# Altium project DataloggerHMIV9.PrjPcb
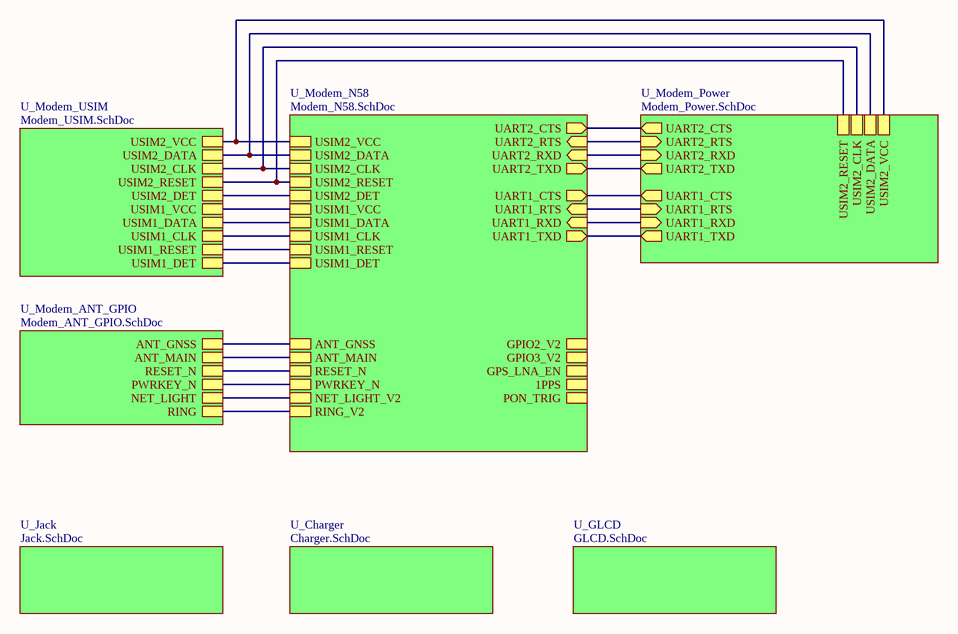
[diagram p0: Master.SchDoc]
4 sheets, 203 parts. Net scope: hierarchical (ports join the sheet entries above them; power ports are global).
Board file: DataloggerMini.PcbDoc
Sheets:
  Master.SchDoc
    U_Jack = Jack.SchDoc
    U_Charger = Charger.SchDoc
    U_GLCD = GLCD.SchDoc

## Sheet Master.SchDoc
size A4; Organization: Altium Limited; Address1: L3, 12a Rodborough Rd; Address2: Frenchs Forest; Address3: NSW; Address4: Australia 2086; DocumentNumber: 1; SheetNumber: 1; SheetTotal: 8

### Sub-sheets
U_Charger = Charger.SchDoc: no entries
U_GLCD = GLCD.SchDoc: no entries
U_Jack = Jack.SchDoc: no entries
U_Modem_ANT_GPIO = Modem_ANT_GPIO.SchDoc (file not in this document): ANT_GNSS, ANT_MAIN, RESET_N, PWRKEY_N, NET_LIGHT, RING
U_Modem_N58 = Modem_N58.SchDoc (file not in this document): RING_V2, USIM2_VCC, USIM2_DATA, USIM2_CLK, USIM2_RESET, USIM2_DET, USIM1_VCC, USIM1_DATA, USIM1_CLK, USIM1_RESET, USIM1_DET, RESET_N, PWRKEY_N, PON_TRIG, UART2_RTS (in), UART2_CTS (out), UART2_RXD (in), UART2_TXD (out), GPIO2_V2, GPIO3_V2, ANT_MAIN, GPS_LNA_EN, 1PPS, ANT_GNSS, NET_LIGHT_V2, UART1_RTS (in), UART1_CTS (out), UART1_RXD (in), UART1_TXD (out)
U_Modem_Power = Modem_Power.SchDoc (file not in this document): UART2_RTS (in), UART2_TXD (out), UART2_RXD (in), UART2_CTS (out), UART1_RTS (in), UART1_TXD (out), UART1_RXD (in), UART1_CTS (out), USIM2_VCC, USIM2_DATA, USIM2_CLK, USIM2_RESET
U_Modem_USIM = Modem_USIM.SchDoc (file not in this document): USIM1_VCC, USIM1_DET, USIM1_DATA, USIM1_CLK, USIM1_RESET, USIM2_VCC, USIM2_DET, USIM2_DATA, USIM2_CLK, USIM2_RESET

### Nets
(unnamed): sheet U_Modem_Power/UART2_RTS, sheet U_Modem_N58/UART2_RTS
(unnamed): sheet U_Modem_Power/UART2_TXD, sheet U_Modem_N58/UART2_TXD
(unnamed): sheet U_Modem_Power/UART2_RXD, sheet U_Modem_N58/UART2_RXD
(unnamed): sheet U_Modem_Power/UART2_CTS, sheet U_Modem_N58/UART2_CTS
(unnamed): sheet U_Modem_Power/UART1_RTS, sheet U_Modem_N58/UART1_RTS
(unnamed): sheet U_Modem_Power/UART1_TXD, sheet U_Modem_N58/UART1_TXD
(unnamed): sheet U_Modem_Power/UART1_RXD, sheet U_Modem_N58/UART1_RXD
(unnamed): sheet U_Modem_Power/UART1_CTS, sheet U_Modem_N58/UART1_CTS
(unnamed): sheet U_Modem_Power/USIM2_VCC, sheet U_Modem_N58/USIM2_VCC, sheet U_Modem_USIM/USIM2_VCC
(unnamed): sheet U_Modem_Power/USIM2_DATA, sheet U_Modem_N58/USIM2_DATA, sheet U_Modem_USIM/USIM2_DATA
(unnamed): sheet U_Modem_Power/USIM2_CLK, sheet U_Modem_N58/USIM2_CLK, sheet U_Modem_USIM/USIM2_CLK
(unnamed): sheet U_Modem_Power/USIM2_RESET, sheet U_Modem_N58/USIM2_RESET, sheet U_Modem_USIM/USIM2_RESET
(unnamed): sheet U_Modem_N58/RING_V2, sheet U_Modem_ANT_GPIO/RING
(unnamed): sheet U_Modem_N58/USIM2_DET, sheet U_Modem_USIM/USIM2_DET
(unnamed): sheet U_Modem_N58/USIM1_VCC, sheet U_Modem_USIM/USIM1_VCC
(unnamed): sheet U_Modem_N58/USIM1_DATA, sheet U_Modem_USIM/USIM1_DATA
(unnamed): sheet U_Modem_N58/USIM1_CLK, sheet U_Modem_USIM/USIM1_CLK
(unnamed): sheet U_Modem_N58/USIM1_RESET, sheet U_Modem_USIM/USIM1_RESET
(unnamed): sheet U_Modem_N58/USIM1_DET, sheet U_Modem_USIM/USIM1_DET
(unnamed): sheet U_Modem_N58/RESET_N, sheet U_Modem_ANT_GPIO/RESET_N
(unnamed): sheet U_Modem_N58/PWRKEY_N, sheet U_Modem_ANT_GPIO/PWRKEY_N
(unnamed): sheet U_Modem_N58/ANT_MAIN, sheet U_Modem_ANT_GPIO/ANT_MAIN
(unnamed): sheet U_Modem_N58/ANT_GNSS, sheet U_Modem_ANT_GPIO/ANT_GNSS
(unnamed): sheet U_Modem_N58/NET_LIGHT_V2, sheet U_Modem_ANT_GPIO/NET_LIGHT

### Notes on the sheet
- Title
- Size:
- Date:
- MiniDatalogger
- A4
- Time:
- Drawn by:
- Bach
- Revision:
- Sheet
- of
- Sonrad
- 385 Tran Dai Nghia
- Hai Ba Trung
- Ha Noi
- Viet Nam
- File:

## Sheet Jack.SchDoc
size Tabloid; Organization: Altium Limited; Address1: L3, 12a Rodborough Rd; Address2: Frenchs Forest; Address3: NSW; Address4: Australia 2086; DocumentNumber: 8; SheetNumber: 8; SheetTotal: 8
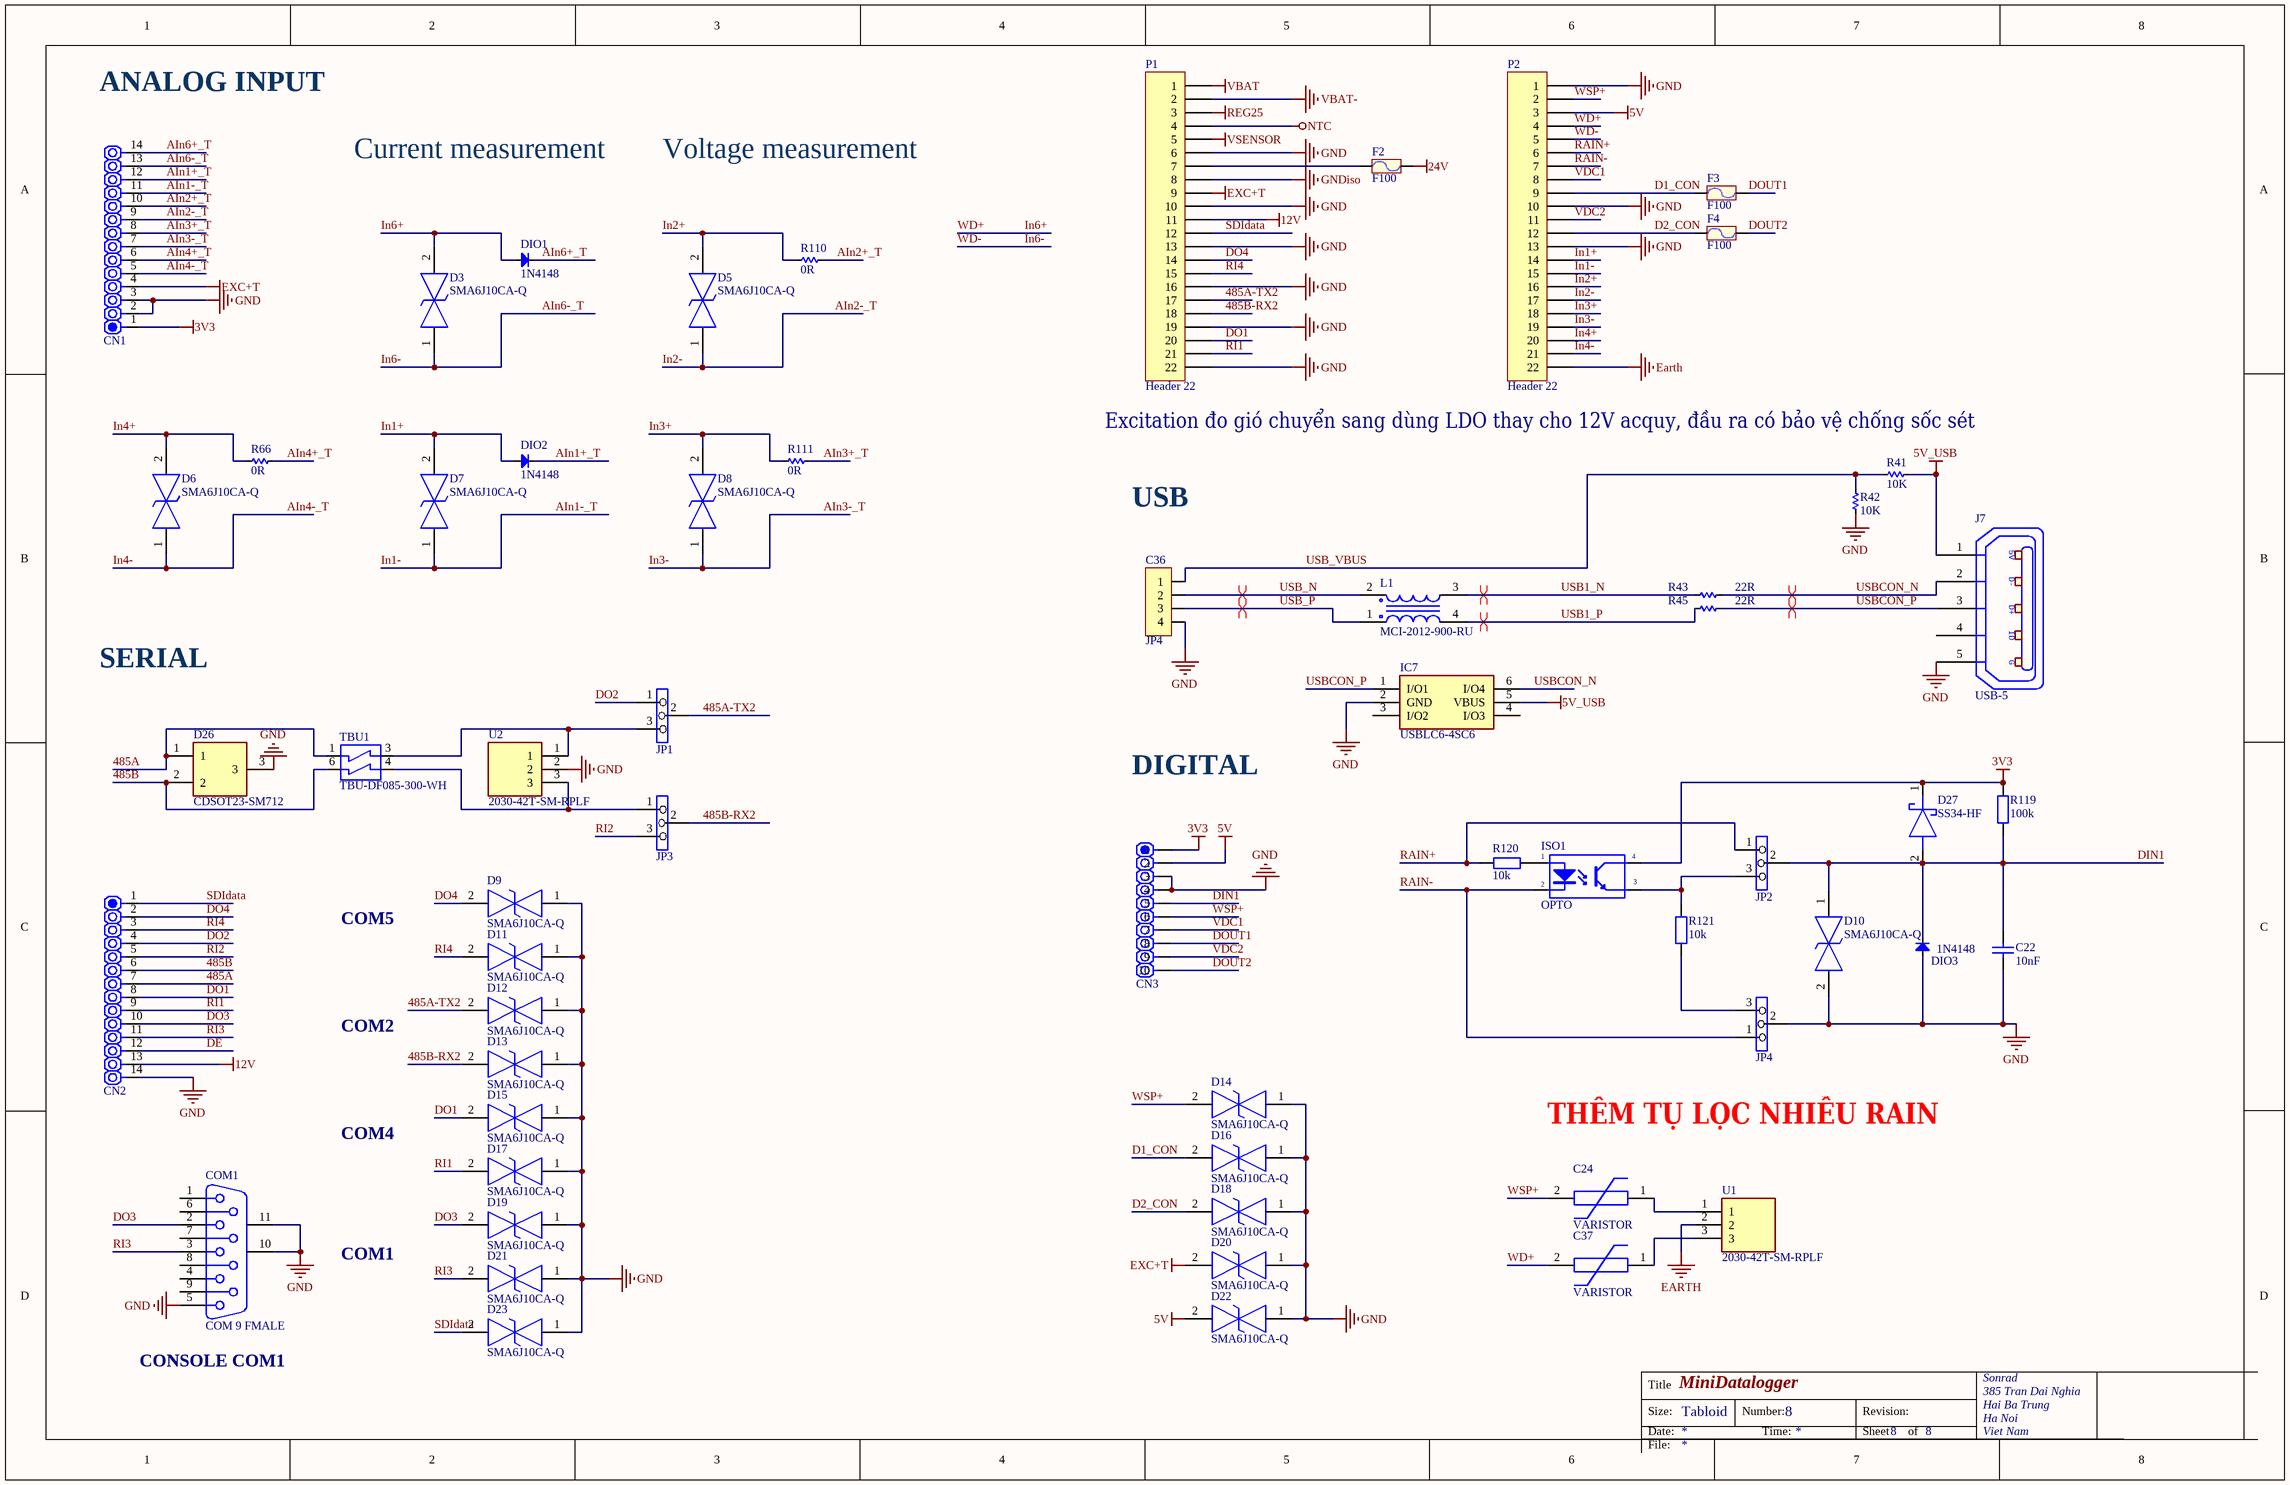
[diagram p1: Jack.SchDoc]

### Parts
C22  10nF  [0805 CAP]
C24  VARISTOR  [CN2]
C36  JP4  [JP4-C1T]
C37  VARISTOR  [CN2]
CN1  CON.HDR1x14  [CON1X14N]  (value not drawn)
CN2  CON.HDR1x14  [CON1X14N]  (value not drawn)
CN3  CON.HDR1x10  [HDR1X10]  (value not drawn)
COM1  COM 9 FMALE  [61800925123]
D3  SMA6J10CA-Q  [DIONM5127X229N]
D5  SMA6J10CA-Q  [DIONM5127X229N]
D6  SMA6J10CA-Q  [DIONM5127X229N]
D7  SMA6J10CA-Q  [DIONM5127X229N]
D8  SMA6J10CA-Q  [DIONM5127X229N]
D9  SMA6J10CA-Q  [DIONM5127X229N]
D10  SMA6J10CA-Q  [DIONM5127X229N]
D11  SMA6J10CA-Q  [DIONM5127X229N]
D12  SMA6J10CA-Q  [DIONM5127X229N]
D13  SMA6J10CA-Q  [DIONM5127X229N]
D14  SMA6J10CA-Q  [DIONM5127X229N]
D15  SMA6J10CA-Q  [DIONM5127X229N]
D16  SMA6J10CA-Q  [DIONM5127X229N]
D17  SMA6J10CA-Q  [DIONM5127X229N]
D18  SMA6J10CA-Q  [DIONM5127X229N]
D19  SMA6J10CA-Q  [DIONM5127X229N]
D20  SMA6J10CA-Q  [DIONM5127X229N]
D21  SMA6J10CA-Q  [DIONM5127X229N]
D22  SMA6J10CA-Q  [DIONM5127X229N]
D23  SMA6J10CA-Q  [DIONM5127X229N]
D26  CDSOT23-SM712  [SOT95P230X117-3N]
D27  SS34-HF  [DIOM5025X220N]
DIO1  1N4148  [DIO-SMD-123]
DIO2  1N4148  [DIO-SMD-123]
DIO3  1N4148  [DIO-SMD-123]
F2  F100  [Fuse1A]
F3  F100  [Fuse1A]
F4  F100  [Fuse1A]
IC7  USBLC6-4SC6  [SOT95P280X145-6N]
ISO1  OPTO  [PC817 SMD]
J7  USB-5  [USB_B_MINI_SMD]
JP1  Jumper 3 pins  [Header 3]  (value not drawn)
JP2  Jumper 3 pins  [Header 3]  (value not drawn)
JP3  Jumper 3 pins  [Header 3]  (value not drawn)
JP4  Jumper 3 pins  [Header 3]  (value not drawn)
L1  MCI-2012-900-RU  [MCI-2012-900-RU]
P1  Header 22  [KF250_KEFA_22P_PHOENIX]
P2  Header 22  [KF250_KEFA_22P_PHOENIX]
R41  10K  [RES-SMD-0805]
R42  10K  [RES-SMD-0805]
R43  22R  [RES-SMD-0805]
R45  22R  [RES-SMD-0805]
R66  0R  [RES-SMD-0805]
R110  0R  [RES-SMD-0805]
R111  0R  [RES-SMD-0805]
R119  100k  [SM-0805]
R120  10k  [SM-0805]
R121  10k  [SM-0805]
TBU1  TBU-DF085-300-WH  [TBU-DF085-300-WH]
U1  2030-42T-SM-RPLF  [203042TSMRPLF]
U2  2030-42T-SM-RPLF  [203042TSMRPLF]

### Nets
3V3: CN1.1 CN3.1 D27.1(K) ISO1.4(C) R119.2
5V: CN3.2 D22.2 P2.3
5V_USB: IC7.5(VBUS) J7.1(P1) R41.1
12V: CN2.13 P1.11
24V: F2.2
Earth: P2.22 U1.2
EXC+T: CN1.4 D20.2 P1.9
GND: C22.1 C36.4 CN1.2 CN1.3 CN2.14 CN3.3 CN3.4 COM1.5 COM1.10(MH1) COM1.11(MH2) D9.1 D10.2 D11.1 D12.1 D13.1 D14.1 D15.1 D16.1 D17.1 D18.1 D19.1 D20.1 D21.1 D22.1 D23.1 D26.3 DIO3.1(A) IC7.2(GND) J7.5(P5) JP4.2 P1.6 P1.10 P1.13 P1.16 P1.19 P1.22 P2.1 P2.10 P2.13 R42.2 U2.2
GNDiso: P1.8
NTC: P1.4
REG25: P1.3
VBAT: P1.1
VBAT-: P1.2
VSENSOR: P1.5
485A: CN2.7 D26.1 TBU1.1(IN1)
485A-TX2: D12.2 JP1.2 P1.17
485B: CN2.6 D26.2 TBU1.6
485B-RX2: D13.2 JP3.2 P1.18
AIn1+_T: CN1.12 DIO2.2(K)
AIn1-_T: CN1.11 D7.1 P2.15  [also labelled In1-]
AIn2+_T: CN1.10 R110.1
AIn2-_T: CN1.9 D5.1 P2.17  [also labelled In2-]
AIn3+_T: CN1.8 R111.1
AIn3-_T: CN1.7 D8.1 P2.19  [also labelled In3-]
AIn4+_T: CN1.6 R66.1
AIn4-_T: CN1.5 D6.1 P2.21  [also labelled In4-]
AIn6+_T: CN1.14 DIO1.2(K)
AIn6-_T: CN1.13 D3.1 P2.5  [also labelled In6-, WD-]
D1_CON: D16.2 F3.1 P2.9
D2_CON: D18.2 F4.1 P2.12
DE: CN2.12
DIN1: C22.2 CN3.5 D10.1 D27.2(A) DIO3.2(K) JP2.2 R119.1
DO1: CN2.8 D15.2 P1.20
DO2: CN2.4 JP1.1
DO3: CN2.10 COM1.2 D19.2
DO4: CN2.2 D9.2 P1.14
DOUT1: CN3.8 F3.2
DOUT2: CN3.10 F4.2
In1+: D7.2 DIO2.1(A) P2.14
In2+: D5.2 P2.16 R110.2
In3+: D8.2 P2.18 R111.2
In4+: D6.2 P2.20 R66.2
In6+: C37.2 D3.2 DIO1.1(A) P2.4  [also labelled WD+]
RAIN+: JP2.1 P2.6 R120.1
RAIN-: ISO1.2(K) JP4.1 P2.7
RI1: CN2.9 D17.2 P1.21
RI2: CN2.5 JP3.3
RI3: CN2.11 COM1.3 D21.2
RI4: CN2.3 D11.2 P1.15
SDIdata: CN2.1 D23.2 P1.12
USB1_N: L1.3 R43.2
USB1_P: L1.4 R45.2
USB_N: C36.2 L1.2
USB_P: C36.3 L1.1
USB_VBUS: C36.1 R41.2 R42.1
USBCON_N: IC7.6(I/O4) J7.2(P2) R43.1
USBCON_P: IC7.1(I/O1) J7.3(P3) R45.1
VDC1: CN3.7 P2.8
VDC2: CN3.9 P2.11
WSP+: C24.2 CN3.6 D14.2 P2.2
NetC24_1: C24.1 U1.1
NetC37_1: C37.1 U1.3
NetF2_1: F2.1 P1.7
NetISO1_1: ISO1.1(A) R120.2
NetISO1_3: ISO1.3(E) JP2.3 R121.1
NetJP1_3: JP1.3 TBU1.3(IN1) U2.1
NetJP3_1: JP3.1 TBU1.4(IN1) U2.3
NetJP4_3: JP4.3 R121.2

Not connected (* = marked no-connect by the designer): COM1 1 4 6 7 8 9; IC7 3(I/O2) 4(I/O3); J7 4(P4)

### Layout directives
differential pair; differential pair class USB: USB1_N, USB1_P, USB_N, USB_P, USBCON_N, USBCON_P

### Notes on the sheet
- ANALOG INPUT
- Current measurement
- Voltage measurement
- Excitation đo gió chuyển sang dùng LDO thay cho 12V acquy, đầu ra có bảo vệ chống sốc sét
- USB
- SERIAL
- DIGITAL
- COM5
- COM2
- COM4
- THÊM TỤ LỌC NHIỄU RAIN
- COM1
- (near COM1) CONSOLE COM1
- Title
- Size:
- Date:
- MiniDatalogger
- Tabloid
- Number:
- Time:
- Revision:
- Sheet
- of
- Sonrad
- 385 Tran Dai Nghia
- Hai Ba Trung
- Ha Noi
- Viet Nam
- File:
- (in symbol USB-5) 5V; D-; D+; ID; G

### Library data of the parts
C22 = CAP CERAMIC: Published: 8-Jun-2000; LatestRevisionDate: 17-Jul-2002; LatestRevisionNote: Re-released for DXP Platform.; PackageReference: RAD-0.3; Publisher: Altium Limited
C24 C37 = VARISTOR: Value: VR 10K
C36 = JP4: WR-PHD 2.54 mm Angled Socket Header; Manufacturer: W¨¹rth Elektronik eiSos GmbH; partNo: 613004143121; ComponentLink1 Description: Manufacturer; ComponentLink2 Description: Datasheet; NoPins: 04; Created Date: 29 March 2013; ComponentLink1URL: http://www.we-online.com; ComponentLink2URL: http://katalog.we-online.de/em/datasheet/6130xx143121.pdf; Created by: Karrer Zheng
CN1 CN2 = CON.HDR1x14: Header 1x14; Publisher: Hoang Nguyen; ComponentLink1Description: Digikey Part link; ComponentLink2Description: Open DataSheet; ComponentLink2URL: H:\LIBRARY\LIBRARY.Datasheet\
CN3 = CON.HDR1x10: Header 1x10; Publisher: Hoang Nguyen; ComponentLink1Description: Digikey Part link; ComponentLink2Description: Open DataSheet; ComponentLink2URL: H:\LIBRARY\LIBRARY.Datasheet\
COM1 = DSB9F: COM 9; PackageDocument: O; Positions: 9; Gender: Receptacle; Value: COM 9; Published: 15-Jun-2001; LatestRevisionDate: 17-Jul-2002; LatestRevisionNote: Re-released for DXP Platform.; DatasheetDocument: 1-Sep-1999; PackageReference: 788750; Publisher: Altium Limited; Orientation: Right Angle
D3 D5-D23 = SMA6J10CA-Q: TVS Diode (Bi-directional); Manufacturer_Name: Bourns; Datasheet Link: https://www.bourns.com/docs/product-datasheets/sma6j-q.pdf?sfvrsn=4a9a7af6_53; Height: 2.29mm; Manufacturer_Part_Number: SMA6J10CA-Q; Mouser Part Number: 652-SMA6J10CA-Q; Mouser Price/Stock: https://www.mouser.co.uk/ProductDetail/Bourns/SMA6J10CA-Q?qs=BJlw7L4Cy79QGk2EpmeXhg%3D%3D
D26 = CDSOT23-SM712: Diode; Manufacturer_Name: Bourns; Datasheet Link: http://uk.rs-online.com/web/p/products/7673728; Height: 1.17mm; Manufacturer_Part_Number: CDSOT23-SM712; Mouser Part Number: 652-CDSOT23-SM712; Mouser Price/Stock: https://www.mouser.co.uk/ProductDetail/Bourns/CDSOT23-SM712?qs=FuI%252BOVLl4%2FLTY%2FGQ265RLA%3D%3D; Arrow Part Number: CDSOT23-SM712; Arrow Price/Stock: https://www.arrow.com/en/products/cdsot23-sm712/bourns
D27 = SS34-HF: Schottky Diode; Manufacturer_Name: Comchip Technology; Datasheet Link: https://ms.componentsearchengine.com/Datasheets/1/SS34-HF.pdf; Height: 2.2mm; Manufacturer_Part_Number: SS34-HF; Mouser Part Number: 750-SS34-HF; Mouser Price/Stock: https://www.mouser.co.uk/ProductDetail/Comchip-Technology/SS34-HF?qs=%252B6g0mu59x7Kt0FF4l3l3pg%3D%3D; Arrow Part Number: SS34-HF; Arrow Price/Stock: https://www.arrow.com/en/products/ss34-hf/comchip-technology
DIO1-DIO3 = Diode SMD: Default Diode; Code - JEDEC: DO-214-AB; Value: 1N5007; Published: 8-Jun-2000; Revision: July-2002: Re-released for DXP Platform.; Publisher: Altium Limited
F2-F4 = Fuse: Designed by: VanDungEvn; Value: Fuse
IC7 = USBLC6-4SC6: Integrated Circuit; Manufacturer_Name: STMicroelectronics; Datasheet Link: http://www.st.com/st-web-ui/static/active/en/resource/technical/document/datasheet/CD00047494.pdf; Height: 1.45mm; Manufacturer_Part_Number: USBLC6-4SC6; Mouser Part Number: 511-USBLC6-4SC6; Mouser Price/Stock: https://www.mouser.co.uk/ProductDetail/STMicroelectronics/USBLC6-4SC6?qs=k9dH%2Fx4GHJCNdehb8zInZg%3D%3D; Arrow Part Number: USBLC6-4SC6; Arrow Price/Stock: https://www.arrow.com/en/products/usblc6-4sc6/stmicroelectronics?region=nac
ISO1 = OPTO: Value: TLP5211
J7 = USB-5: Manufacturer: FCI; Manufacturer Part Number: 10118193-0001LF; Connector Type: USB - micro B; Number of Contacts: 5; Gender: Receptacle; Specifications: USB 2.0; .Creator: MM; .Checked PCB: RF; Supplier 1: Digi-Key; RoHS: RoHS Compliant; Category: Connectors, Interconnects; Stock 1: 28642; Pricing 1: 1=0.46, 10=0.433, 25=0.3712, 50=0.3156, 100=0.3032, 250=0.27224, 500=0.25988 (USD); Packaging: Cut Tape (CT); Mounting Type: Surface Mount, Right Angle, Horizontal; Features: Shielded, Solder Retention; Ingress Protection: -; ComponentLink1URL: http://portal.fciconnect.com/Comergent//fci/drawing/10118193.pdf; ComponentLink1Description: http://portal.fciconnect.com/Comergent//fci/drawing/10118193.pdf; Supplier Part Number 1: 609-4616-1-ND; .Checked SCH: MM
JP1-JP4 = Jumper3: ECCN_US/EU: n/a
R41-R43 R45 R66 R110 R111 = Res-SMD: Resistor; Manufacturer: Generic Components; Class: Passive; Published: 08/06/2000; Publisher: Altium Hobart Technology Centre
R119-R121 = RM: Resistor SMD; Value: 1K
U1 U2 = 2030-42T-SM-RPLF: Undefined or Miscellaneous; Manufacturer_Name: Bourns; Datasheet Link: https://www.mouser.com/datasheet/2/54/030-xxt-sm-776307.pdf; Height: 5.3mm; Manufacturer_Part_Number: 2030-42T-SM-RPLF; Mouser Part Number: 652-2030-42T-SM-RPLF; Mouser Price/Stock: https://www.mouser.co.uk/ProductDetail/Bourns/2030-42T-SM-RPLF?qs=5MvhVKkHFQUQcmaLkL8YYA%3D%3D; Arrow Part Number: 2030-42T-SM-RPLF; Arrow Price/Stock: https://www.arrow.com/en/products/2030-42t-sm-rplf/bourns
P1 P2 = Header 22: LatestRevisionDate: 17-Jul-2002; LatestRevisionNote: Re-released for DXP Platform.; Publisher: Altium Limited

## Sheet Charger.SchDoc
size Tabloid; Organization: Altium Limited; Address1: L3, 12a Rodborough Rd; Address2: Frenchs Forest; Address3: NSW; Address4: Australia 2086; DocumentNumber: 3; SheetNumber: 3; SheetTotal: 8
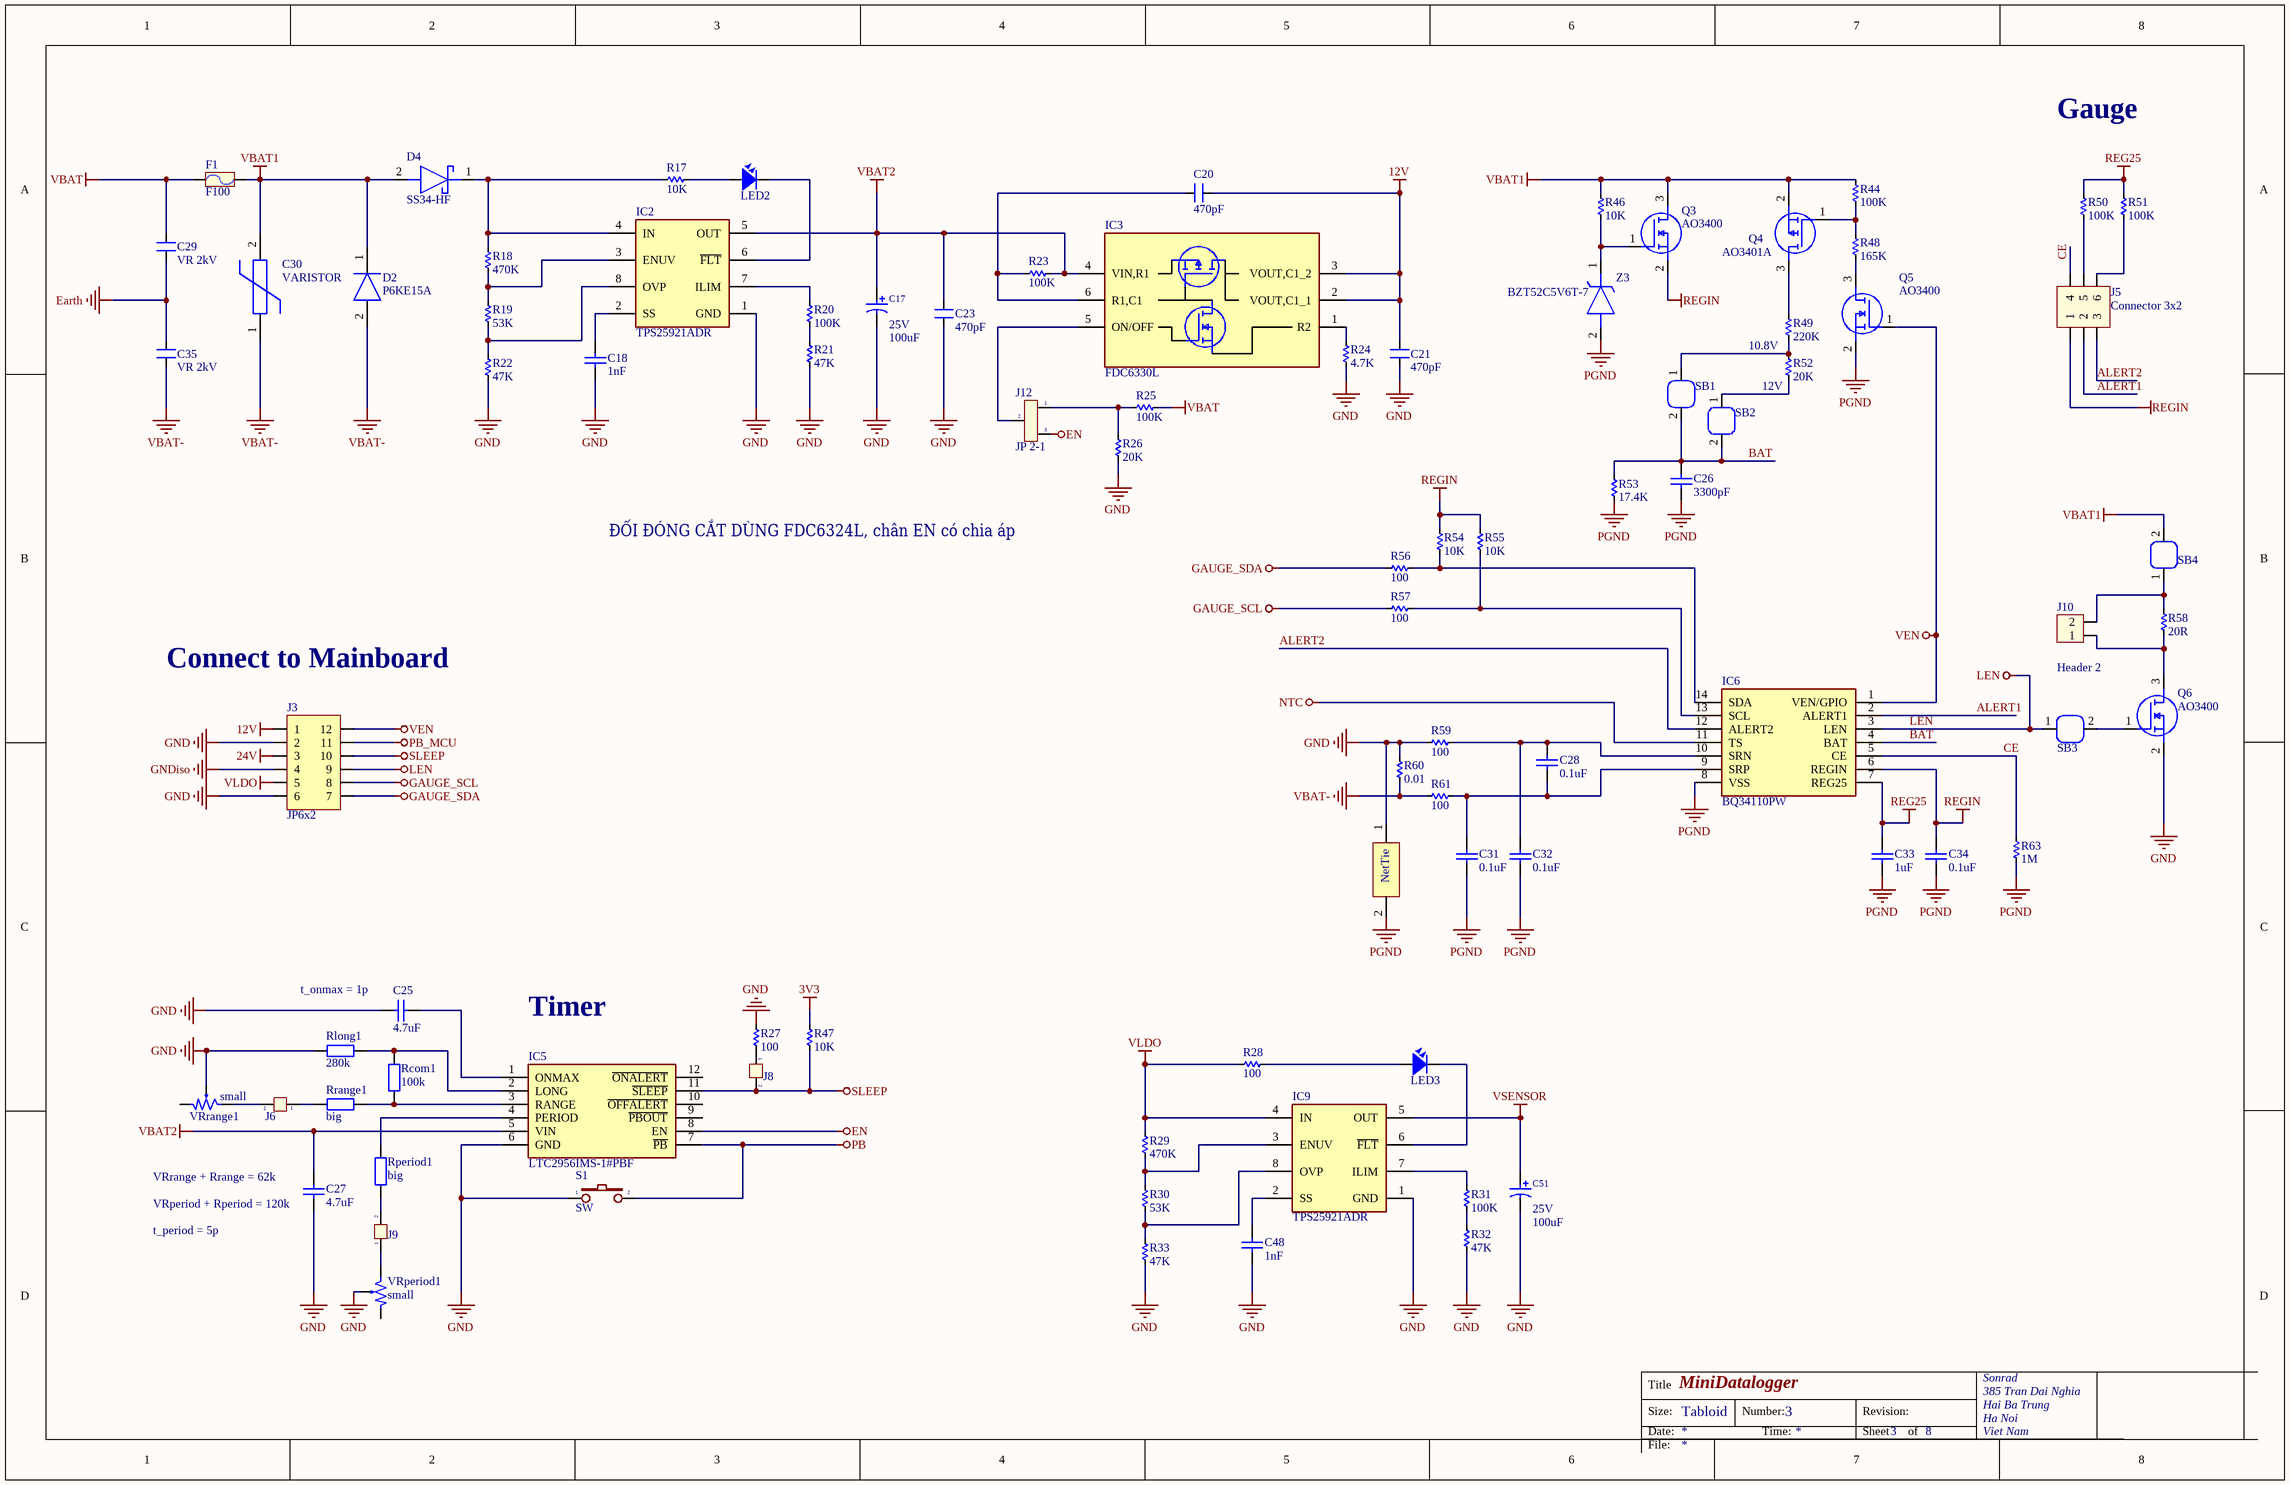
[diagram p2: Charger.SchDoc]

### Parts
*  NetTie  [NetTie]  (value not drawn)
C17  value 100uF  Volt: 25V  [Cap SMD Tant]  (hidden comment: 100 uF 25V)
C18  1nF  [0805 CAP]
C20  470pF  [SM-0805]
C21  470pF  [SM-0805]
C23  470pF  [SM-0805]
C25  4.7uF  [0805 CAP]
C26  3300pF  [0805 CAP]
C27  4.7uF  [0805 CAP]
C28  0.1uF  [0805 CAP]
C29  VR 2kV  [CN3]
C30  VARISTOR  [CN2]
C31  0.1uF  [0805 CAP]
C32  0.1uF  [0805 CAP]
C33  1uF  [0805 CAP]
C34  0.1uF  [0805 CAP]
C35  VR 2kV  [CN3]
C48  1nF  [0805 CAP]
C51  value 100uF  Volt: 25V  [Cap SMD Tant]  (hidden comment: 100 uF 25V)
D2  P6KE15A  [P6KE15A]
D4  SS34-HF  [DIOM5025X220N]
F1  F100  [Fuse1A]
IC2  TPS25921ADR  [SOIC127P600X175-8N]
IC3  FDC6330L  [SOT95P280X110-6N]
IC5  LTC2956IMS-1#PBF  [SOP65P490X110-12N]
IC6  BQ34110PW  [SOP65P640X120-14N]
IC9  TPS25921ADR  [SOIC127P600X175-8N]
J3  JP6x2  [JP6-D2T]
J5  Connector 3x2  [JP3x2]
J6  Jumper 2  [JP2]  (value not drawn)
J8  Jumper 2  [JP2]  (value not drawn)
J9  Jumper 2  [JP2]  (value not drawn)
J10  Header 2  [HED2B]
J12  JP 2-1  [JP3]
LED2  LED  [LED 3512]  (value not drawn)
LED3  LED  [LED 3512]  (value not drawn)
Q3  AO3400  [SOT95P280X125-3N]
Q4  AO3401A  [SOT95P280X125-3N]
Q5  AO3400  [SOT95P280X125-3N]
Q6  AO3400  [SOT95P280X125-3N]
R17  10K  [RES-SMD-0805]
R18  470K  [RES-SMD-0805]
R19  53K  [RES-SMD-0805]
R20  100K  [RES-SMD-0805]
R21  47K  [RES-SMD-0805]
R22  47K  [RES-SMD-0805]
R23  100K  [RES-SMD-0805]
R24  4.7K  [RES-SMD-0805]
R25  100K  [RES-SMD-0805]
R26  20K  [RES-SMD-0805]
R27  100  [RES-SMD-0805]
R28  100  [RES-SMD-0805]
R29  470K  [RES-SMD-0805]
R30  53K  [RES-SMD-0805]
R31  100K  [RES-SMD-0805]
R32  47K  [RES-SMD-0805]
R33  47K  [RES-SMD-0805]
R44  100K  [RES-SMD-0805]
R46  10K  [RES-SMD-0805]
R47  10K  [RES-SMD-0805]
R48  165K  [RES-SMD-0805]
R49  220K  [RES-SMD-0805]
R50  100K  [RES-SMD-0805]
R51  100K  [RES-SMD-0805]
R52  20K  [RES-SMD-0805]
R53  17.4K  [RES-SMD-0805]
R54  10K  [RES-SMD-0805]
R55  10K  [RES-SMD-0805]
R56  100  [RES-SMD-0805]
R57  100  [RES-SMD-0805]
R58  20R  [RES-SMD-2512]
R59  100  [RES-SMD-0805]
R60  0.01  [RES-SMD-1210]
R61  100  [RES-SMD-0805]
R63  1M  [RES-SMD-0805]
Rcom1  100k  [0805 RESISTOR]
Rlong1  280k  [0805 RESISTOR]
Rperiod1  big  [0805 RESISTOR]
Rrange1  big  [0805 RESISTOR]
S1  SW  [SW2]
SB1  Solder bridge  [Solder Bridge]  (value not drawn)
SB2  Solder bridge  [Solder Bridge]  (value not drawn)
SB3  Solder bridge  [Solder Bridge]  (value not drawn)
SB4  Solder bridge  [Solder Bridge]  (value not drawn)
VRperiod1  small  [VR1]
VRrange1  small  [VR1]
Z3  BZT52C5V6T-7  [SODFL1608X65N]

### Nets
3V3: R47.2
12V: C20.2 C21.1 IC3.2(VOUT,C1_1) IC3.3(VOUT,C1_2) J3.1
24V: J3.3
Earth: C29.1 C35.2
EN: IC5.8(EN) J12.3
GAUGE_SCL: J3.8 R57.1
GAUGE_SDA: J3.7 R56.1
GND: *.1 C17.2 C18.2 C21.2 C23.2 C25.2 C27.1 C48.2 C51.2 IC2.1(GND) IC5.6(GND) IC9.1(GND) J3.2 J3.6 Q6.2(S) R21.1 R22.1 R24.1 R26.1 R27.2 R32.1 R33.1 R59.1 R60.1 Rlong1.1 S1.1 VRperiod1.2 VRrange1.2
GNDiso: J3.4
LEN: IC6.3(LEN) J3.9 SB3.1
NTC: IC6.11(TS)
PB: IC5.7(~{PB}) S1.2
PB_MCU: J3.11
PGND: *.2 C26.1 C31.1 C32.1 C33.1 C34.1 IC6.8(VSS) Q5.2(S) R53.1 R63.1 Z3.2(A)
REG25: C33.2 IC6.7(REG25) R50.2 R51.2
REGIN: C34.2 IC6.6(REGIN) J5.1 Q3.2(S) R54.2 R55.2
SLEEP: IC5.11(~{SLEEP}) J3.10 J8.2 R47.1
VBAT: C29.2 F1.1 R25.1
VBAT1: C30.2 D2.1(K) D4.2(A) F1.2 Q3.3(D) Q4.2(S) R44.2 R46.2 SB4.2
VBAT2: C17.1 C23.1 C27.2 IC2.5(OUT) IC3.4(VIN,R1) IC5.5(VIN) R23.1
VBAT-: C30.1 C35.1 D2.2(A) R60.2 R61.1
VEN: IC6.1(VEN/GPIO) J3.12 Q5.1(G)
VLDO: IC9.4(IN) J3.5 R28.1 R29.2
VSENSOR: C51.1 IC9.5(OUT)
ALERT1: IC6.2(ALERT1) J5.5(2)
ALERT2: IC6.12(ALERT2) J5.6(3)
BAT: C26.2 IC6.4(BAT) R53.2 SB1.2 SB2.2
CE: IC6.5(CE) J5.4 R63.2
NetC18_1: C18.1 IC2.2(SS)
NetC20_1: C20.1 IC3.6(R1,C1) R23.2
NetC25_1: C25.1 IC5.1(ONMAX)
NetC28_1: C28.1 C31.2 IC6.9(SRP) R61.2
NetC28_2: C28.2 C32.2 IC6.10(SRN) R59.2
NetC48_1: C48.1 IC9.2(SS)
NetD4_1: D4.1(K) IC2.4(IN) R17.1 R18.2
NetIC2_3: IC2.3(ENUV) R18.1 R19.2
NetIC2_6: IC2.6(~{FLT}) LED2.2
NetIC2_7: IC2.7(ILIM) R20.2
NetIC2_8: IC2.8(OVP) R19.1 R22.2
NetIC3_1: IC3.1(R2) R24.2
NetIC3_5: IC3.5(ON/OFF) J12.2
NetIC5_2: IC5.2(LONG) Rcom1.2 Rlong1.2
NetIC5_3: IC5.3(RANGE) Rcom1.1 Rrange1.2
NetIC5_4: IC5.4(PERIOD) Rperiod1.2
NetIC6_13: IC6.13(SCL) R55.1 R57.2
NetIC6_14: IC6.14(SDA) R54.1 R56.2
NetIC9_3: IC9.3(ENUV) R29.1 R30.2
NetIC9_6: IC9.6(~{FLT}) LED3.2
NetIC9_7: IC9.7(ILIM) R31.2
NetIC9_8: IC9.8(OVP) R30.1 R33.2
NetJ5_2: J5.2(5) R50.1
NetJ5_3: J5.3(6) R51.1
NetJ6_1: J6.1 Rrange1.1
NetJ6_2: J6.2 VRrange1.3
NetJ8_1: J8.1 R27.1
NetJ9_1: J9.1 VRperiod1.3
NetJ9_2: J9.2 Rperiod1.1
NetJ10_1: J10.1 Q6.3(D) R58.1
NetJ10_2: J10.2 R58.2 SB4.1
NetJ12_1: J12.1 R25.2 R26.2
NetLED2_1: LED2.1 R17.2
NetLED3_1: LED3.1 R28.2
NetQ3_1: Q3.1(G) R46.1 Z3.1(K)
NetQ4_1: Q4.1(G) R44.1 R48.2
NetQ4_3: Q4.3(D) R49.2
NetQ5_3: Q5.3(D) R48.1
NetQ6_1: Q6.1(G) SB3.2
NetR20_1: R20.1 R21.2
NetR31_1: R31.1 R32.2
NetR49_1: R49.1 R52.2 SB1.1
NetR52_1: R52.1 SB2.1

Not connected (* = marked no-connect by the designer): IC5 9(~{PBOUT}) 10(~{OFFALERT}) 12(~{ONALERT}); VRperiod1 1; VRrange1 1

### Notes on the sheet
- Gauge
- 10.8V
- (near R52) 12V
- ĐỔI ĐÓNG CẮT DÙNG FDC6324L, chân EN có chia áp
- Connect to Mainboard
- (near C25) t_onmax = 1p
- Timer
- (near C27) VRrange + Rrange = 62k
- (near C27) VRperiod + Rperiod = 120k
- t_period = 5p
- Title
- Size:
- Date:
- MiniDatalogger
- Tabloid
- Number:
- Time:
- Revision:
- Sheet
- of
- Sonrad
- 385 Tran Dai Nghia
- Hai Ba Trung
- Ha Noi
- Viet Nam
- File:

### Library data of the parts
C17 C51 = Cap_Pol: Polarized Tanta Capacitor; Manufacturer: FARNELL; AEMS Code: 2100110; Vendor: Digikey; Published: 13-April-2009; Publisher: Hoang Nguyen; ComponentLink1Description: Digikey Part Link; ComponentLink2Description: Open Datasheet; ComponentLink2URL: H:\LIBRARY\LIBRARY.Datasheet\
C18 C25-C28 C31-C34 C48 = CAP CERAMIC: Published: 8-Jun-2000; LatestRevisionDate: 17-Jul-2002; LatestRevisionNote: Re-released for DXP Platform.; PackageReference: RAD-0.3; Publisher: Altium Limited
C20 C21 C23 = CM: Cap SMD; Value: 103
C29 C35 = CN3: MOV; Value: 0,047uF; Copyright: VanDungEvn
C30 = VARISTOR: Value: VR 10K
D2 = P6KE15A: Diode; Manufacturer_Name: STMicroelectronics; Datasheet Link: http://www.st.com/web/en/resource/technical/document/datasheet/CD00000720.pdf; Manufacturer_Part_Number: P6KE15A; Mouser Part Number: 511-P6KE15A; Mouser Price/Stock: https://www.mouser.co.uk/ProductDetail/STMicroelectronics/P6KE15A?qs=TGPpmpbSrT5hhHGF%252BJ4hqw%3D%3D; Arrow Part Number: P6KE15A; Arrow Price/Stock: https://www.arrow.com/en/products/p6ke15a/stmicroelectronics
D4 = SS34-HF: as D27 on sheet Jack; Datasheet Link: https://ms.componentsearchengine.com/Datasheets/1/SS34-HF.pdf; Height: 2.2mm; Manufacturer_Part_Number: SS34-HF; Mouser Part Number: 750-SS34-HF; Mouser Price/Stock: https://www.mouser.co.uk/ProductDetail/Comchip-Technology/SS34-HF?qs=%252B6g0mu59x7Kt0FF4l3l3pg%3D%3D; Arrow Part Number: SS34-HF; Arrow Price/Stock: https://www.arrow.com/en/products/ss34-hf/comchip-technology
F1 = Fuse: Designed by: VanDungEvn; Value: Fuse
IC2 IC9 = TPS25921ADR: Integrated Circuit; Manufacturer_Name: Texas Instruments; Datasheet Link: http://www.ti.com/lit/gpn/tps25921a; Height: 1.75mm; Manufacturer_Part_Number: TPS25921ADR; Mouser Part Number: 595-TPS25921ADR; Mouser Price/Stock: https://www.mouser.co.uk/ProductDetail/Texas-Instruments/TPS25921ADR?qs=m%2F7bTylgptfvwfVPRm0ALQ%3D%3D; Arrow Part Number: TPS25921ADR; Arrow Price/Stock: https://www.arrow.com/en/products/tps25921adr/texas-instruments
IC3 = FDC6330L: Integrated Circuit; Manufacturer_Name: ON Semiconductor; Datasheet Link: http://docs-emea.rs-online.com/webdocs/10df/0900766b810df4e7.pdf; Height: 1.1mm; Manufacturer_Part_Number: FDC6330L; Mouser Part Number: 512-FDC6330L; Mouser Price/Stock: https://www.mouser.co.uk/ProductDetail/ON-Semiconductor-Fairchild/FDC6330L?qs=efMQ9B2bthfkfJJoj5%252B07g%3D%3D; Arrow Part Number: FDC6330L; Arrow Price/Stock: https://www.arrow.com/en/products/fdc6330l/on-semiconductor
IC5 = LTC2956IMS-1#PBF: Integrated Circuit; Manufacturer_Name: Analog Devices; Datasheet Link: https://componentsearchengine.com/Datasheets/1/LTC2956IMS-1#PBF.pdf; Height: 1.1mm; Manufacturer_Part_Number: LTC2956IMS-1#PBF; Mouser Part Number: 584-LTC2956IMS-1#PBF; Mouser Price/Stock: https://www.mouser.com/Search/Refine.aspx?Keyword=584-LTC2956IMS-1%23PBF; Arrow Part Number: LTC2956IMS-1#PBF; Arrow Price/Stock: https://www.arrow.com/en/products/ltc2956ims-1pbf/analog-devices
IC6 = BQ34110PW: Integrated Circuit; Manufacturer_Name: Texas Instruments; Datasheet Link: http://www.ti.com/lit/gpn/bq34110; Height: 1.2mm; Manufacturer_Part_Number: BQ34110PW; Mouser Part Number: 595-BQ34110PW; Mouser Price/Stock: https://www.mouser.co.uk/ProductDetail/Texas-Instruments/BQ34110PW?qs=OEYMhS7p3YbAd6vB%252BTGmNQ%3D%3D; Arrow Part Number: BQ34110PW; Arrow Price/Stock: https://www.arrow.com/en/products/bq34110pw/texas-instruments
J3 = JP6x2: WR-PHD 2.54 mm Dual Socket Header; Manufacturer: W¨¹rth Elektronik eiSos GmbH; partNo: 61301221821; ComponentLink1 Description: Manufacturer; ComponentLink2 Description: Datasheet; NoPins: 12; Created Date: 29 March 2013; ComponentLink1URL: http://www.we-online.com; ComponentLink2URL: http://katalog.we-online.de/em/datasheet/6130xx21821.pdf; Created by: Karrer Zheng
J5 = JP3x2: Value: Connector 3x2
J6 J8 J9 = JP 2: Value: JP 2
J10 = Hed2: Header 2 (Green); Value: Header 2
J12 = JP 2-1: Jumper 2-1; Value: J2-1
LED2 LED3 = LED SMD: Value: LED 3 - 5 ly 2 Colour
Q3 Q5 Q6 = AO3400: MOSFET (N-Channel); Manufacturer_Name: Alpha & Omega Semiconductors; Datasheet Link: http://aosmd.com/res/data_sheets/AO3400.pdf; Height: 1.25mm; Manufacturer_Part_Number: AO3400; Arrow Part Number: AO3400; Arrow Price/Stock: https://www.arrow.com/en/products/ao3400/alpha-and-omega-semiconductor
Q4 = AO3401A: MOSFET (P-Channel); Manufacturer_Name: Alpha & Omega Semiconductors; Datasheet Link: http://www.aosmd.com/pdfs/datasheet/AO3401A.pdf; Height: 1.25mm; Manufacturer_Part_Number: AO3401A; Arrow Part Number: AO3401A; Arrow Price/Stock: https://www.arrow.com/en/products/ao3401a/alpha-and-omega-semiconductor
R17-R33 R44 R46-R61 R63 = Res-SMD: as R41 on sheet Jack; Published: 08/06/2000; Publisher: Altium Hobart Technology Centre
Rcom1 Rlong1 Rperiod1 Rrange1 = RESISTOR: Value: R1/4W - 1K
S1 = SW2: Switch button 2 pin; Value: SW chip 2 pin
VRperiod1 VRrange1 = VR1: Var Resistor; Value: VR 10K
Z3 = BZT52C5V6T-7: Zener Diode; Manufacturer_Name: Diodes Inc.; Datasheet Link: https://www.mouser.com/datasheet/2/115/ds30502-1142513.pdf; Height: 0.65mm; Manufacturer_Part_Number: BZT52C5V6T-7; Mouser Part Number: 621-BZT52C5V6T-7; Mouser Price/Stock: https://www.mouser.co.uk/ProductDetail/Diodes-Incorporated/BZT52C5V6T-7/?qs=zLeapIUCO8Tm%252BIuaCPAdkQ%3D%3D; Arrow Part Number: BZT52C5V6T-7; Arrow Price/Stock: https://www.arrow.com/en/products/bzt52c5v6t-7/diodes-incorporated

## Sheet GLCD.SchDoc
size Tabloid; Organization: Altium Limited; Address1: L3, 12a Rodborough Rd; Address2: Frenchs Forest; Address3: NSW; Address4: Australia 2086; DocumentNumber: 2; SheetNumber: 2; SheetTotal: 8
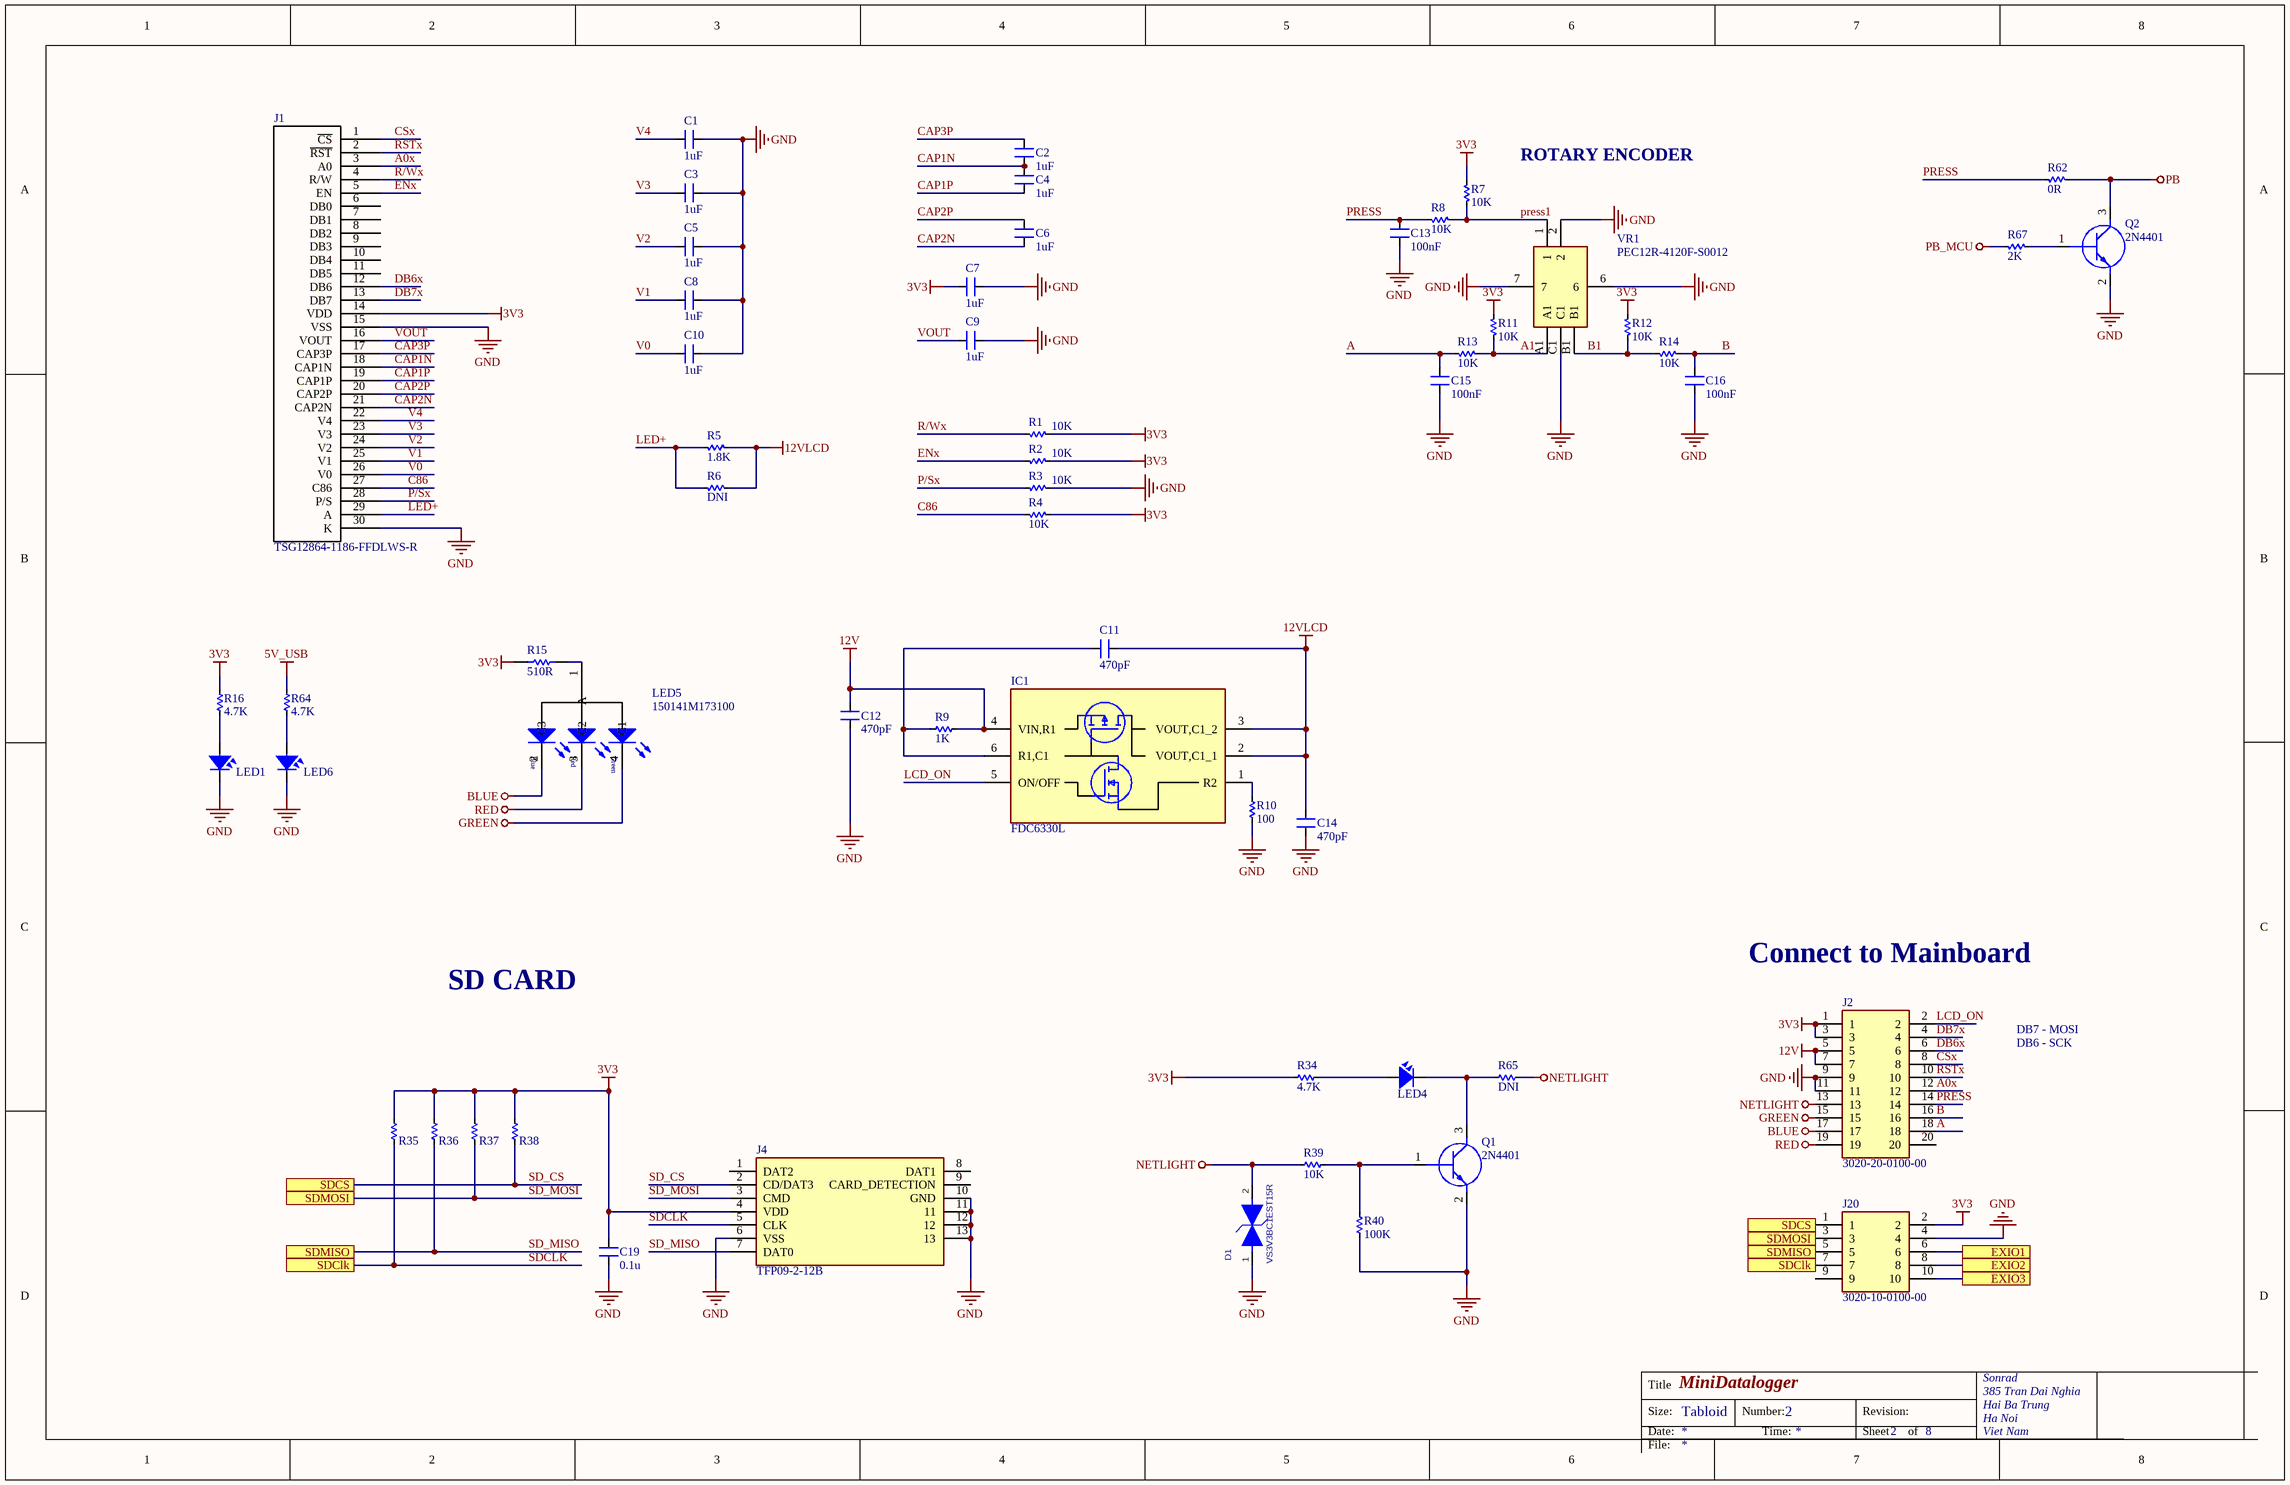
[diagram p3: GLCD.SchDoc]

### Parts
C1  1uF  [SM-0805]
C2  1uF  [SM-0805]
C3  1uF  [SM-0805]
C4  1uF  [SM-0805]
C5  1uF  [SM-0805]
C6  1uF  [SM-0805]
C7  1uF  [SM-0805]
C8  1uF  [SM-0805]
C9  1uF  [SM-0805]
C10  1uF  [SM-0805]
C11  470pF  [SM-0805]
C12  470pF  [SM-0805]
C13  100nF  [SM-0805]
C14  470pF  [SM-0805]
C15  100nF  [SM-0805]
C16  100nF  [SM-0805]
C19  0.1u  [SM-0805]
D1  value VS3V3BC1EST15R  [0603 RESISTOR]  (hidden comment: TVS_BI_ESD5431N-2/TR_DFN1006-2L)
IC1  FDC6330L  [SOT95P280X110-6N]
J1  TSG12864-1186-FFDLWS-R  [TGS2864-1186-FFDLWS-R]
J2  3020-20-0100-00  [SHDR20W65P254_2X10_3302X900X900P]
J4  TFP09-2-12B  [TFP09212B]
J20  3020-10-0100-00  [SHDR10W65P254_2X5_2032X880X920P]
LED1  LED  [LED 3512]  (value not drawn)
LED4  LED  [LED 3512]  (value not drawn)
LED5  150141M173100  [LED RGB 3528]
LED6  LED  [LED 3512]  (value not drawn)
Q1  2N4401  [SOT96P237X111-3N]
Q2  2N4401  [SOT96P237X111-3N]
R1  10K  [RES-SMD-0805]
R2  10K  [RES-SMD-0805]
R3  10K  [RES-SMD-0805]
R4  10K  [RES-SMD-0805]
R5  1.8K  [RES-SMD-0805]
R6  DNI  [RES-SMD-0805]
R7  10K  [RES-SMD-0805]
R8  10K  [RES-SMD-0805]
R9  1K  [RES-SMD-0805]
R10  100  [RES-SMD-0805]
R11  10K  [RES-SMD-0805]
R12  10K  [RES-SMD-0805]
R13  10K  [RES-SMD-0805]
R14  10K  [RES-SMD-0805]
R15  510R  [R2012-0805]
R16  4.7K  [RES-SMD-0805]
R34  4.7K  [RES-SMD-0805]
R35  100R  [RES-SMD-0805]  (value not drawn)
R36  100R  [RES-SMD-0805]  (value not drawn)
R37  100R  [RES-SMD-0805]  (value not drawn)
R38  100R  [RES-SMD-0805]  (value not drawn)
R39  10K  [RES-SMD-0805]
R40  100K  [RES-SMD-0805]
R62  0R  [RES-SMD-0805]
R64  4.7K  [RES-SMD-0805]
R65  DNI  [RES-SMD-0805]
R67  2K  [RES-SMD-0805]
VR1  PEC12R-4120F-S0012  [EC11-SMD-12.5mm]

### Ports
EXIO1, EXIO2, EXIO3, SDClk, SDCS, SDMISO, SDMOSI

### Nets
3V3: C7.1 C19.2 J1.14(VDD) J2.1 J2.3 J4.4(VDD) J20.2 R1.2 R2.2 R4.2 R7.2 R11.2 R12.2 R15.2 R16.1 R34.2 R35.2 R36.2 R37.2 R38.2
5V_USB: R64.1
12V: C12.2 IC1.4(VIN,R1) J2.5 J2.7 R9.1
12VLCD: C11.2 C14.1 IC1.2(VOUT,C1_1) IC1.3(VOUT,C1_2) R5.2 R6.2
BLUE: J2.17 LED5.2(C3)
GND: C1.1 C3.1 C5.1 C7.2 C8.1 C9.2 C10.1 C12.1 C13.1 C14.2 C15.1 C16.1 C19.1 D1.1 J1.15(VSS) J1.30(K) J2.9 J2.11 J4.6(VSS) J4.10(GND) J4.11 J4.12 J4.13 J20.4 LED1.2 LED6.2 Q1.2(E) Q2.2(E) R3.2 R10.1 R40.1 VR1.2 VR1.6 VR1.7 VR1.C1
GREEN: J2.15 LED5.4(C1)
NETLIGHT: D1.2 J2.13 R39.2 R65.1
PB: Q2.3(C) R62.1
PB_MCU: R67.2
RED: J2.19 LED5.3(C2)
A: C15.2 J2.18 R13.1
A0x: J1.3(A0) J2.12
A1: R11.1 R13.2 VR1.A1
B: C16.2 J2.16 R14.2
B1: R12.1 R14.1 VR1.B1
C86: J1.27(C86) R4.1
CAP1N: C2.2 C4.1 J1.18(CAP1N)
CAP1P: C4.2 J1.19(CAP1P)
CAP2N: C6.2 J1.21(CAP2N)
CAP2P: C6.1 J1.20(CAP2P)
CAP3P: C2.1 J1.17(CAP3P)
CSx: J1.1(~{CS}) J2.8
DB6x: J1.12(DB6) J2.6
DB7x: J1.13(DB7) J2.4
ENx: J1.5(EN) R2.1
LCD_ON: IC1.5(ON/OFF) J2.2
LED+: J1.29(A) R5.1 R6.1
P/Sx: J1.28(P/S) R3.1
PRESS: C13.2 J2.14 R8.2 R62.2
press1: R7.1 R8.1 VR1.1
R/Wx: J1.4(R/W) R1.1
RSTx: J1.2(~{RST}) J2.10
SD_CS: J4.2(CD/DAT3) J20.1 R38.1 ; port SDCS
SD_MISO: J4.7(DAT0) J20.5 R36.1 ; port SDMISO
SD_MOSI: J4.3(CMD) J20.3 R37.1 ; port SDMOSI
SDCLK: J4.5(CLK) J20.7 R35.1 ; port SDClk
V0: C10.2 J1.26(V0)
V1: C8.2 J1.25(V1)
V2: C5.2 J1.24(V2)
V3: C3.2 J1.23(V3)
V4: C1.2 J1.22(V4)
VOUT: C9.1 J1.16(VOUT)
NetC11_1: C11.1 IC1.6(R1,C1) R9.2
NetIC1_1: IC1.1(R2) R10.2
NetJ20_6: J20.6 ; port EXIO1
NetJ20_8: J20.8 ; port EXIO2
NetJ20_10: J20.10 ; port EXIO3
NetLED1_1: LED1.1 R16.2
NetLED4_1: LED4.1 R34.1
NetLED4_2: LED4.2 Q1.3(C) R65.2
NetLED5_1: LED5.1(A) R15.1
NetLED6_1: LED6.1 R64.2
NetQ1_1: Q1.1(B) R39.1 R40.2
NetQ2_1: Q2.1(B) R67.1

Not connected (* = marked no-connect by the designer): J1 6(DB0) 7(DB1) 8(DB2) 9(DB3) 10(DB4) 11(DB5); J2 20; J4 1(DAT2) 8(DAT1) 9(CARD_DETECTION); J20 9

### Notes on the sheet
- ROTARY ENCODER
- Connect to Mainboard
- SD CARD
- DB7 - MOSI
- DB6 - SCK
- Title
- Size:
- Date:
- MiniDatalogger
- Tabloid
- Number:
- Time:
- Revision:
- Sheet
- of
- Sonrad
- 385 Tran Dai Nghia
- Hai Ba Trung
- Ha Noi
- Viet Nam
- File:
- (in symbol LED RGB SMD) Blue; Red; Green

### Library data of the parts
C1-C16 C19 = CM: Cap SMD; Value: 103
D1 = TVS_BI_ESD5431N-2/TR_DFN1006-2L: Ppp:100W;Vrwm:±3.3V;Vbr:3.4V min;Vc:10.0V;Ipp:10.0A;Cj:17.5pF typ;ESD Voltage:±30KV(air);±30KV(contact);Tj:-55℃ to 150℃; MFR: WILL; Geometry.Height: 0.5mm; SN: 40300027; TYPE: TVS管; DESC: TVS_Bi-directional_3.3V_DFN1006-2L; MPN: ESD5431N-2/TR; PCB Footprint: DFN1006-2L; PCB DECAL: DFN1006-2L
IC1 = FDC6330L: as IC3 on sheet Charger; Datasheet Link: http://docs-emea.rs-online.com/webdocs/10df/0900766b810df4e7.pdf; Height: 1.1mm; Manufacturer_Part_Number: FDC6330L; Mouser Part Number: 512-FDC6330L; Mouser Price/Stock: https://www.mouser.co.uk/ProductDetail/ON-Semiconductor-Fairchild/FDC6330L?qs=efMQ9B2bthfkfJJoj5%252B07g%3D%3D; Arrow Part Number: FDC6330L; Arrow Price/Stock: https://www.arrow.com/en/products/fdc6330l/on-semiconductor
J2 = 3020-20-0100-00: Connector; Manufacturer_Name: CNC Tech; Datasheet Link: http://cnctech.us/pdfs/3020-XX-0100-00.pdf; Height: 9mm; Manufacturer_Part_Number: 3020-20-0100-00; Arrow Part Number: 3020-20-0100-00; Arrow Price/Stock: https://www.arrow.com/en/products/3020-20-0100-00/cnc-tech-llc
J4 = TFP09-2-12B: Connector; Manufacturer_Name: 100y; Datasheet Link: http://images.100y.com.tw/pdf_file/10-TFP09-2-12B.pdf; Height: 2.45mm; Manufacturer_Part_Number: TFP09-2-12B
J20 = 3020-10-0100-00: Connector; Manufacturer_Name: CNC Tech; Datasheet Link: http://cnctech.us/pdfs/3020-XX-0100-00.pdf; Height: 9.2mm; Manufacturer_Part_Number: 3020-10-0100-00; Arrow Part Number: 3020-10-0100-00; Arrow Price/Stock: https://www.arrow.com/en/products/3020-10-0100-00/cnc-tech-llc
LED1 LED4 LED6 = LED SMD: Value: LED 3 - 5 ly 2 Colour
LED5 = LED RGB SMD: SMD Full-Color Top LED, WL-SFTW, Red & Green & Blue; Manufacturer: Würth Elektronik eiSos GmbH; PartNo: 150141M173100; ComponentLink1Description: Manufacturer; ComponentLink1URL: http://www.we-online.de; Created by: Christin Otto; Created Date: June 2013; ComponentLink2Description: Datasheet; ComponentLink2URL: http://katalog.we-online.com/led/datasheet/150141M173100.pdf; Color: Red & Green & Blue
Q1 Q2 = SBC848BLT1G: Transistor BJT NPN; Manufacturer_Name: ON Semiconductor; Datasheet Link: http://www.onsemi.com/pub/Collateral/BC846ALT1-D.PDF; Height: 1.11mm; Manufacturer_Part_Number: SBC848BLT1G; Mouser Part Number: 863-SBC848BLT1G; Mouser Price/Stock: https://www.mouser.co.uk/ProductDetail/ON-Semiconductor/SBC848BLT1G?qs=VZpK7o2ExSTLObuTFok7EA%3D%3D; Arrow Part Number: SBC848BLT1G; Arrow Price/Stock: https://www.arrow.com/en/products/sbc848blt1g/on-semiconductor
R1-R14 R16 R34-R40 R62 R64 R65 R67 = Res-SMD: as R41 on sheet Jack; Published: 08/06/2000; Publisher: Altium Hobart Technology Centre
R15 = Res_0_5%_0402: Resistor; Manuf_Part_1: RC0402JR-070RL; Manuf_1: YAGEO; Value: 0; Order: 2363467; ECCN_US/EU: n/a; Distrib: FARNELL
VR1 = PEC12R-4120F-S0012: Variable Resistor; Manufacturer_Name: Bourns; Datasheet Link: https://componentsearchengine.com/Datasheets/1/PEC12R-4120F-S0012.pdf; Height: 20mm; Manufacturer_Part_Number: PEC12R-4120F-S0012; Mouser Part Number: 652-PEC12R-4120F-S12; Mouser Price/Stock: https://www.mouser.co.uk/ProductDetail/Bourns/PEC12R-4120F-S0012?qs=Zq5ylnUbLm6clFsEUuj3oA%3D%3D; Arrow Part Number: PEC12R-4120F-S0012; Arrow Price/Stock: https://www.arrow.com/en/products/pec12r-4120f-s0012/bourns

## Nets that join several sheets
3V3: Jack (5 pins), Charger (R47.2), GLCD (20 pins)
5V_USB: Jack (IC7.5 J7.1 R41.1), GLCD (R64.1)
12V: Jack (CN2.13 P1.11), Charger (5 pins), GLCD (5 pins)
24V: Jack (F2.2), Charger (J3.3)
Earth: Jack (P2.22 U1.2), Charger (C29.1 C35.2)
GND: Jack (41 pins), Charger (28 pins), GLCD (35 pins)
GNDiso: Jack (P1.8), Charger (J3.4)
NTC: Jack (P1.4), Charger (IC6.11)
PB: Charger (IC5.7 S1.2), GLCD (Q2.3 R62.1)
PB_MCU: Charger (J3.11), GLCD (R67.2)
REG25: Jack (P1.3), Charger (C33.2 IC6.7 R50.2 R51.2)
VBAT: Jack (P1.1), Charger (C29.2 F1.1 R25.1)
VBAT-: Jack (P1.2), Charger (5 pins)
VSENSOR: Jack (P1.5), Charger (C51.1 IC9.5)